# EAGLE design 301_Photodiode_Board (EAGLE 9.6.2)
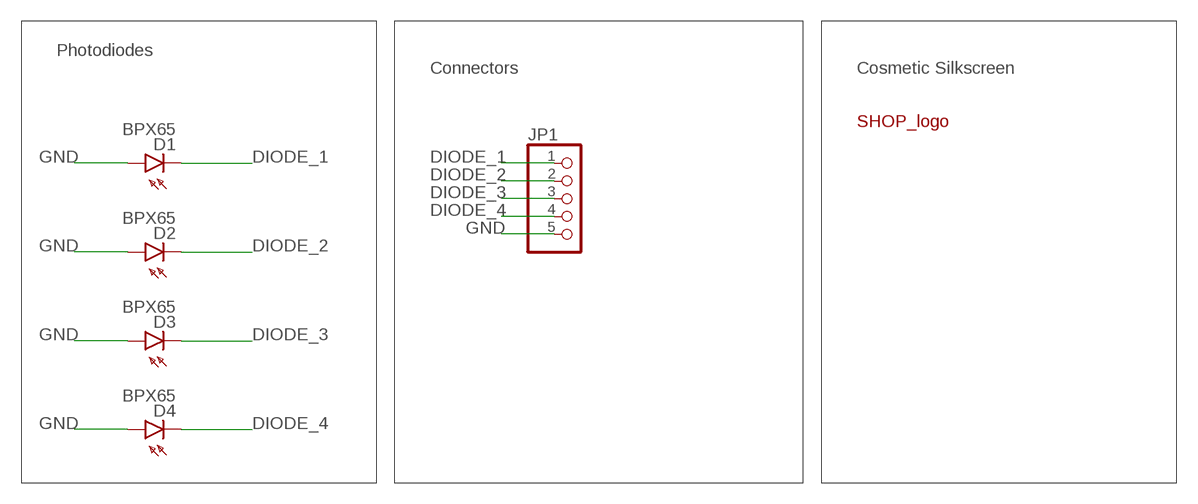
[diagram p0: schematic, sheet 1]

## Parts
D1  BPX65  [BPX65]
D2  BPX65  [BPX65]
D3  BPX65  [BPX65]
D4  BPX65  [BPX65]
JP1  PINHD-1X5  [1X05]
U$2  COUGAR_LOGO_LARGE  [LRG_COUGAR]

## Nets
DIODE_1: D1.K(C) JP1.1
DIODE_2: D2.K(C) JP1.2
DIODE_3: D3.K(C) JP1.3
DIODE_4: D4.K(C) JP1.4
GND: D1.A D2.A D3.A D4.A JP1.5

## Notes on the sheet
- Photodiodes
- Connectors | Cosmetic Silkscreen

## Library data of the parts
D1-D4 = opto-trans-siemens:BPX65: PHOTO DIODE; MPN: BPX65.; OC_FARNELL: 327451; OC_NEWARK: 06WX2764
JP1 = pinhead:PINHD-1X5: PIN HEADER
U$2 = ElcPartsLibrary:COUGAR_LOGO_LARGE

## Board
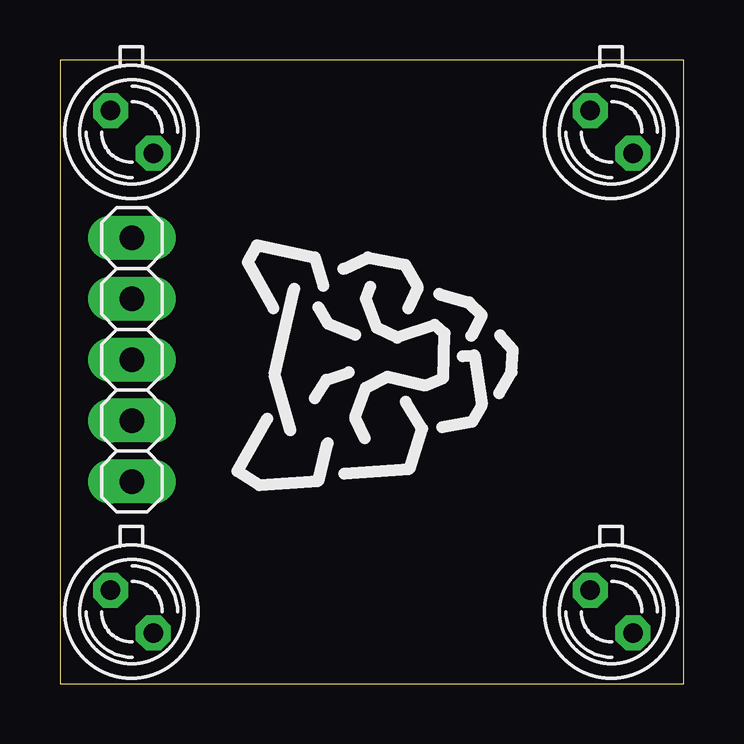
[diagram p1: board, top side]
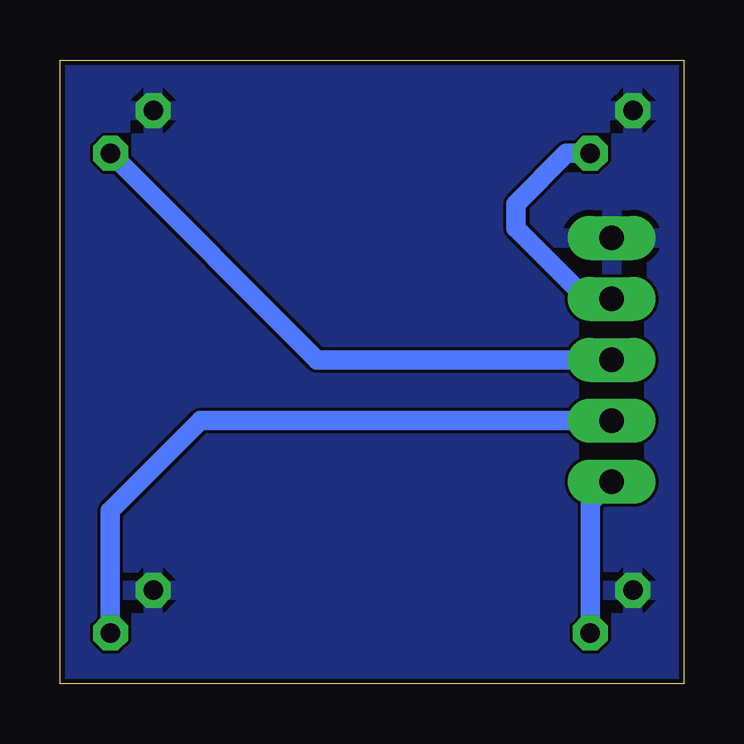
[diagram p2: board, bottom side, seen from below]

Size 26 x 26 mm. Coordinates in mm from the lower left corner, seen from the top.
Outline: 0,0 26,0 26,26 0,26 0,0
Copper layers (1*16): Top 0.035mm / dielectric 1.6mm / Bottom 0.035mm
Design rules "jlcpcb-2layers": minimum track width 5mil, minimum drill 0.3mm, track to track 5mil, track to pad 5mil, pad to pad 5mil, via to via 5mil, smd to smd 5mil, copper to edge 0.2mm, drill to drill 6mil, minimum pad ring 10mil, minimum via ring 3mil, stop-mask expansion 4mil, vias tented up to drill 0mil, thermal gap 10mil

### Footprints (pad centres in the part's own frame; a part is rotated, then mirrored left to right if it is on the bottom)
BPX65 = drill 0.813 octagon: A -0.889,-0.889; K 0.889,0.889
1X05 = drill 1.016 long: 1 -5.08,0; 2 -2.54,0; 3 0,0; 4 2.54,0; 5 5.08,0

### Placement (x,y rotation side)
D1  3,3 270 top
D2  23,3 270 top
D3  23,23 270 top
D4  3,23 270 top
JP1  3,13.5 90 top
U$2  19.11,7.89 90 top

### Tracks (layer width: path | path; a pad name or v marks a point on that pad's centre or on a via)
DIODE_1
  Bottom 0.813: JP1.1 3.89,7.53 D1.K
DIODE_2
  Bottom 0.813: JP1.2 20.14,10.96 23.9,7.2 23.9,2.12 D2.K
DIODE_3
  Bottom 0.813: JP1.3 15.28,13.5 D3.K
DIODE_4
  Bottom 0.813: JP1.4 4.04,16.04 7,19 7,20 4.89,22.11 D4.K
GND
  pour Bottom: -1,27 -1,-1 27,-1 27,27